# Altium schematic sheet Sheet1.SchDoc
size A4; SheetNumber: 1; SheetTotal: 1
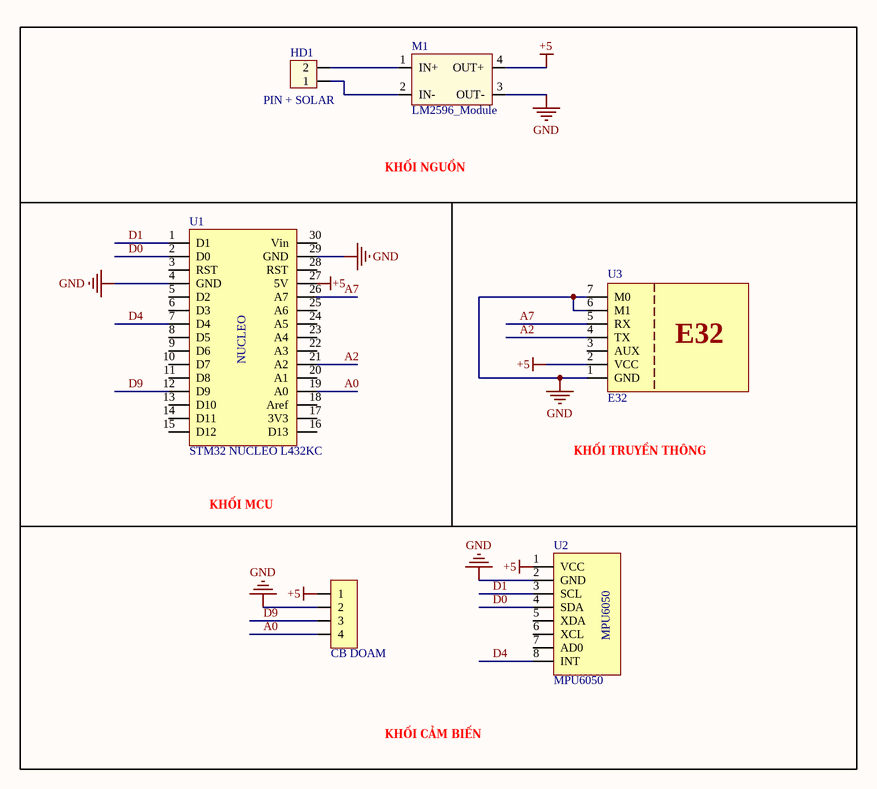
[diagram p0: Sheet1.SchDoc]

## Parts
HD1  PIN + SOLAR  [HED2]
JP1  CB DOAM  [JP 1x4 CC]
M1  LM2596_Module  [LM2596S_Module]
U1  STM32 NUCLEO L432KC  [STM32 NUCLEO L432KC]
U2  MPU6050  [MPU6050]
U3  E32  [E32]

## Nets
+5: JP1.1 M1.4(OUT+) U1.27(5V) U2.1(VCC) U3.2(VCC)
GND: JP1.2 M1.3(OUT-) U1.4(GND) U1.29(GND) U2.2(GND) U3.1(GND) U3.6(M1) U3.7(M0)
A0: JP1.4 U1.19(A0)
A2: U1.21(A2) U3.4(TX)
A7: U1.26(A7) U3.5(RX)
D0: U1.2(D0) U2.4(SDA)
D1: U1.1(D1) U2.3(SCL)
D4: U1.7(D4) U2.8(INT)
D9: JP1.3 U1.12(D9)
NetHD1_1: HD1.1 M1.2(IN-)
NetHD1_2: HD1.2 M1.1(IN+)

Not connected (* = marked no-connect by the designer): U1 3(RST) 5(D2) 6(D3) 8(D5) 9(D6) 10(D7) 11(D8) 13(D10) 14(D11) 15(D12) 16(D13) 17(3V3) 18(Aref) 20(A1) 22(A3) 23(A4) 24(A5) 25(A6) 28(RST) 30(Vin); U2 5(XDA) 6(XCL) 7(AD0); U3 3(AUX)

## Notes on the sheet
- KHỐI NGUỒN
- KHỐI TRUYỀN THÔNG
- KHỐI MCU
- KHỐI CẢM BIẾN
- (in symbol STM32 NUCLEO L432KC) NUCLEO

## Library data of the parts
HD1 = Hed2: Header 2 (Green); Value: Header 2
JP1 = JP 1x4 2.54 Cai Cong: Cắm; Ten_Linh_Kien: Jump Đơn Cái 2.54MM 1x40P Cong; Don_Vi: Con; Ma_Hang: MH001265; Ghi_Chu: *; Kieu_Chan: *; Chung_Loai: Cắm
M1 = LM2596_Module: Module
U3 = E32: Lora